# Altium project SmartGarden_A2.PrjPcb
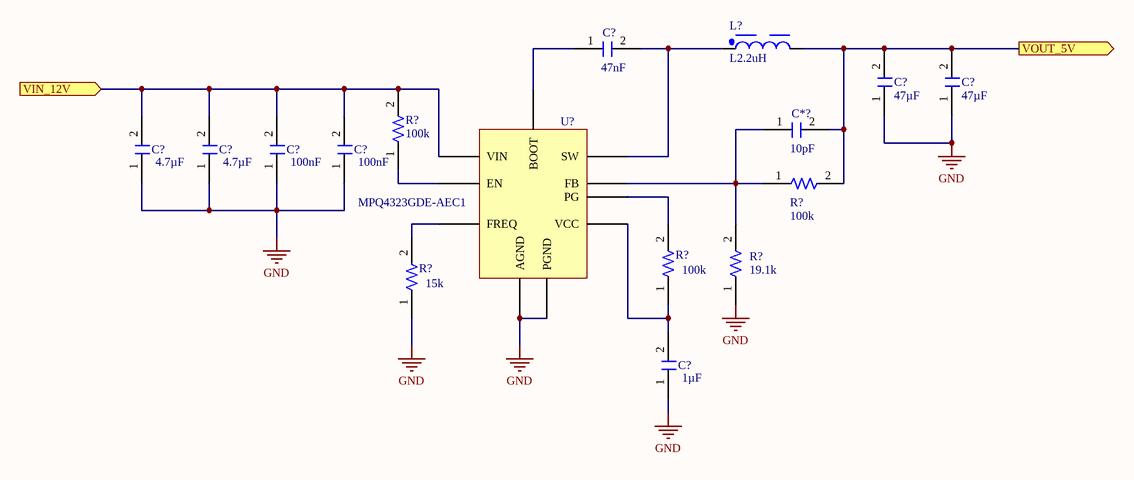
[diagram p0: MPQ4323.SchDoc]
4 sheets, 25 parts. Net scope: hierarchical (ports join the sheet entries above them; power ports are global).
Sheets:
  MPQ4323.SchDoc
  LDO.SchDoc
  MCU.SchDoc
  NTC.SchDoc

## Sheet MPQ4323.SchDoc
size A4; SheetNumber: 6; SheetTotal: 6

### Parts
(Parts that share a designator on the sheet are numbered #1, #2 ... from top to bottom, then left to right.)
C*?  value 10pF  [WCAP-CSGP_0805_L2W1.25H0.6_Reflow]  (hidden comment: C10pF_0805_50V)
C?#1  value 47nF  [WCAP-CSGP_0805_L2W1.25H0.8_Reflow]  (hidden comment: 885012207096)
C?#2  value 47µF  [C1206FNPC-RW]  (hidden comment: C47u-10V-1206FNPC-X5R)
C?#3  value 47µF  [C1206FNPC-RW]  (hidden comment: C47u-10V-1206FNPC-X5R)
C?#4  value 4.7µF  [C0805FNPC-W]  (hidden comment: C4.7u-0805FNPC-X5R)
C?#5  value 4.7µF  [C0805FNPC-W]  (hidden comment: C4.7u-0805FNPC-X5R)
C?#6  value 100nF  [C0805FNPC-R]  (hidden comment: C100n-50V-0805FNPC-X7R)
C?#7  value 100nF  [C0805FNPC-R]  (hidden comment: C100n-50V-0805FNPC-X7R)
C?#8  value 1µF  [C0805FNPC-R]  (hidden comment: C1u-50V-0805FNPC-X7R)
L?  L2.2uH  [WE-PD_7345]
R?#1  value 100k  [RESC2013X70X40NL20T20]  (hidden comment: R100k-0805)
R?#2  value 100k  [RESC2013X70X40NL20T20]  (hidden comment: R100k-0805)
R?#3  value 100k  [RESC2013X70X40NL20T20]  (hidden comment: R100k-0805)
R?#4  value 19.1k  [0805]  (hidden comment: R19.1k_0805)
R?#5  value 15k  [RESC2013X50X30ML20T20]  (hidden comment: R15K-0805)
U?  MPQ4323GDE-AEC1  [MPQ4323]

### Ports
VIN_12V (in, see SG_A2 Architecture[1C]), VOUT_5V (out, see SG_A2 Architecture[1C])

### Nets
GND: C?#2.1 C?#3.1 C?#4.1 C?#5.1 C?#6.1 C?#7.1 C?#8.1 R?#4.1 R?#5.1 U?.4(AGND) U?.5(PGND)
NetC*?_1: C*?.1 R?#2.1 R?#4.2 U?.8(FB)
NetC*?_2: C*?.2 C?#2.2 C?#3.2 L?.2 R?#2.2 ; port VOUT_5V
NetC?#1_1: C?#1.1 U?.10(BOOT)
NetC?#1_2: C?#1.2 L?.1 U?.9(SW)
NetC?#4_2: C?#4.2 C?#5.2 C?#6.2 C?#7.2 R?#1.2 U?.1(VIN) ; port VIN_12V
NetC?#8_2: C?#8.2 R?#3.1 U?.6(VCC)
NetR?#1_1: R?#1.1 U?.2(EN)
NetR?#3_2: R?#3.2 U?.7(PG)
NetR?#5_2: R?#5.2 U?.3(FREQ)

### Library data of the parts
C*? = CMP-001-00012-2: Ceramic Capacitor, Multilayer, Ceramic, 50V, 5% +Tol, 5% -Tol, C0G, 30ppm/Cel TC, 0.00001uF, Surface Mount, 0805. 885012007051; Pins: 2; RoHS Compliant: Yes; Capacitor Type: Ceramic
C?#1 = CMP-001-00011-1: Ceramic Capacitor, Ceramic; RoHS Compliant: Yes; Capacitor Type: Ceramic; Pins: 2
C?#2 C?#3 = CMP-00059-1: Multilayer Ceramic Capacitor, Wcap-Csgp Series, 47 F, 20%, X5r, 10 V, 1206 [3216 Metric]; Manufacturer Part Number 1: 885012108012; Manufacturer 1: Wurth Electronics; Voltage Rating (DC): 10V; .Creator: GP; Packaging: Cut Tape; ComponentLink4Description: Wurth Elektronik; Max Operating Temperature: 85°C; RoHS: Yes; Case Code (Metric): 3216; Length: 0.126inch; Tolerance: 20%; RoHS Compliant: Yes; Source: Passives.SchLib; Min Operating Temperature: -55°C; Stock 1: 2003; Case/Package: 1206; Category: Ceramic Capacitors; ComponentLink3Description: http://www.farnell.com/datasheets/1958457.pdf?src-supplier=Element14; Mount: Surface Mount; Width: 0.063inch; Dielectric: X5R; ComponentLink4URL: https://www.we-online.com/catalog/en/WCAP-CSGP-10VDC?sq=885012108012#885012108012; ComponentLink2URL: https://katalog.we-online.de/pbs/datasheet/885012108012.pdf?src-supplier=Digi-Key; Voltage Rating: 10V; ComponentLink1Description: http://www.farnell.com/datasheets/1958457.pdf?src-supplier=Farnell; Thickness: 0.075inch; REACH SVHC: Unknown; ComponentLink3URL: http://www.farnell.com/datasheets/1958457.pdf?src-supplier=Element14; ComponentLink2Description: https://katalog.we-online.de/pbs/datasheet/885012108012.pdf?src-supplier=Digi-Key; ComponentLink1URL: http://www.farnell.com/datasheets/1958457.pdf?src-supplier=Farnell; Pricing 1: 1=1,26000, 10=1,14000, 100=1,02200, 500=0,90400 (USD); Design Item ID: C47u-10V-1206FNPC-X5R
C?#4 C?#5 = CMP-00047-1: 0805 4.7 uF 10 V ±10% Tolerance X5R Surface Mount Multilayer Ceramic Capacitor; Manufacturer: Murata; Manufacturer Part Number: GRM219R61A475KE34D; Voltage Rating: 10V; .Creator: GP; ComponentLink1URL: https://eu.mouser.com/datasheet/2/396/taiyo_yuden_12132018_mlcc11_hq_e-1510082.pdf; Source: Passives.SchLib; Length: 2mm; ComponentLink5URL: https://datasheet.ciiva.com/16467/product-16467258.pdf?src-supplier=Future+Electronics; RoHS: Yes; Depth: 1.25mm; Pricing 1: 1=0,28000, 10=0,19500, 50=0,13020, 100=0,11070, 500=0,07814, 1000=0,06838 (USD); Width: 0.049inch; ComponentLink7URL: https://datasheet.ciiva.com/29542/product-29542668.pdf?src-supplier=Digi-Key; Category: Capacitor; Voltage: 10V; Thickness: 0.037inch; Max Operating Temperature: 85°C; ComponentLink2Description: Where buy it; Voltage Rating (DC): 10V; Design Item ID: C4.7u-0805FNPC-X5R; Min Operating Temperature: -55°C; Package Quantity: 4000; Stock 1: 626992; ComponentLink4URL: https://datasheet.ciiva.com/5414/product-5414984.pdf?src-supplier=Mouser; ComponentLink4Description: https://datasheet.ciiva.com/5414/product-5414984.pdf?src-supplier=Mouser; ComponentLink7Description: https://datasheet.ciiva.com/29542/product-29542668.pdf?src-supplier=Digi-Key; Lead Free: Lead Free; ComponentLink6URL: https://datasheet.ciiva.com/29542/product-29542667.pdf?src-supplier=Digi-Key; ComponentLink2URL: https://eu.mouser.com/ProductDetail/Taiyo-Yuden/UMK212BJ224KGHT?qs=CNQs48zzdnpf%2FbZJTfp33Q%3D%3D; Construction: Flat; Packaging: Tape and Reel; Tolerance: 10%; Case Code (Metric): 2012; RoHS Compliant: Yes; Mount: Surface Mount; ComponentLink6Description: https://datasheet.ciiva.com/29542/product-29542667.pdf?src-supplier=Digi-Key; ComponentLink3URL: https://datasheet.ciiva.com/169/product-169527.pdf?src-supplier=Digi-Key; Case/Package: 0805; Height: 0.85mm; Termination: SMD/SMT; ComponentLink3Description: https://datasheet.ciiva.com/169/product-169527.pdf?src-supplier=Digi-Key; Series: GRM; ComponentLink1Description: Datasheet; ComponentLink5Description: https://datasheet.ciiva.com/16467/product-16467258.pdf?src-supplier=Future+Electronics; Dielectric: X5R
C?#6 C?#7 = CMP-00063-1: Cap, 0.1ΜF, 50V, 10%, X7R, 0805; Manufacturer 1: Wurth Electronics; Manufacturer Part Number 1: 885012207098; .Creator: DR; Pricing 1: 100=0,10200, 500=0,07100, 2000=0,06100 (GBP); ComponentLink1URL: http://www.farnell.com/datasheets/1958498.pdf?src-supplier=Farnell; Design Item ID: C100n-50V-0805FNPC-X7R; Voltage Rating (DC): 50V; Voltage Rating: 50V; Max Operating Temperature: 125°C; RoHS: Yes; Case Code (Metric): 2012; Mount: Surface Mount; REACH SVHC: Unknown; Stock 1: 8000; Source: Passives.SchLib; Tolerance: 10%; RoHS Compliant: Yes; Dielectric: X7R; ComponentLink2Description: http://www.farnell.com/datasheets/1958498.pdf?src-supplier=Element14; ComponentLink2URL: http://www.farnell.com/datasheets/1958498.pdf?src-supplier=Element14; Min Operating Temperature: -55°C; Width: 0.049inch; Category: Ceramic Capacitors; Thickness: 0.035inch; Length: 0.079inch; ComponentLink3URL: https://katalog.we-online.de/pbs/datasheet/885012207098.pdf?src-supplier=Digi-Key; Case/Package: 0805; ComponentLink3Description: https://katalog.we-online.de/pbs/datasheet/885012207098.pdf?src-supplier=Digi-Key; Packaging: Cut Tape; ComponentLink1Description: http://www.farnell.com/datasheets/1958498.pdf?src-supplier=Farnell; ComponentLink4Description: http://www.farnell.com/datasheets/1958498.pdf?src-supplier=Newark; ComponentLink4URL: http://www.farnell.com/datasheets/1958498.pdf?src-supplier=Newark
C?#8 = CMP-00052-1: Multilayer Ceramic Capacitor, Wcap-Csgp Series, 1 F, 10%, X7R, 50 V, 0805 [2012 Metric] Rohs Compliant: Yes; Manufacturer Part Number 1: 885012207103; Manufacturer 1: Wurth Electronics; Voltage Rating (DC): 50V; .Creator: GP; Max Operating Temperature: 85°C; Case/Package: 0805; ComponentLink1Description: http://www.farnell.com/datasheets/1958501.pdf?src-supplier=Farnell; Design Item ID: C1u-50V-0805FNPC-X7R; ComponentLink1URL: http://www.farnell.com/datasheets/1958501.pdf?src-supplier=Farnell; ComponentLink2Description: http://www.farnell.com/datasheets/1958501.pdf?src-supplier=Element14; ComponentLink3URL: https://katalog.we-online.de/pbs/datasheet/885012107003.pdf?src-supplier=Digi-Key; ComponentLink4Description: http://www.farnell.com/datasheets/1958501.pdf?src-supplier=Newark; Width: 0.049inch; RoHS Compliant: Yes; Case Code (Metric): 2012; Source: Passives.SchLib; Category: Ceramic Capacitors; Tolerance: 10%; Pricing 1: 50=0,27200, 250=0,25300, 500=0,22800, 1250=0,20100, 2500=0,17100 (GBP); RoHS: Yes; Mount: Surface Mount; Min Operating Temperature: -55°C; ComponentLink4URL: http://www.farnell.com/datasheets/1958501.pdf?src-supplier=Newark; Dielectric: X7R; ComponentLink3Description: https://katalog.we-online.de/pbs/datasheet/885012107003.pdf?src-supplier=Digi-Key; ComponentLink2URL: http://www.farnell.com/datasheets/1958501.pdf?src-supplier=Element14; REACH SVHC: Unknown; Length: 0.079inch; Packaging: Cut Tape; Thickness: 0.053inch; Stock 1: 5100; Voltage Rating: 50V
L? = CMP-006-00004-1: General Purpose Inductor, 2.2uH, 20%, 1 Element, Ferrite-Core, SMD. 744777002; Max Current Rating: 6A; Self Resonant Frequency: 60MHz; Pins: 2; RoHS Compliant: Yes; Tolerance: 20%; Min Operating Temperature: -40°C; Max Operating Temperature: 125°C
R?#1-R?#3 = CMP-009-00003-2: Fixed Resistor, Metal Glaze/thick Film, 0.125W, 100000ohm, 150V, 5% +/-Tol, 200ppm/Cel, Surface Mount, 0805; Power: 125mW; Max Operating Temperature: 155°C; Mounting Technology: Surface Mount; RoHS Compliant: Yes; Min Operating Temperature: -55°C; Pins: 2; Case/Package: 0805; Tolerance: 5%
R?#4 = CMP-009-00013-1: Fixed Resistor, Thin Film, 0.125W, 19100ohm, 100V, 0.1% +/-Tol, 15ppm/Cel, Surface Mount, 0805. ERA6APB1912V; Power: 125mW; Tolerance: 0.1%; Min Operating Temperature: -55°C; Mounting Technology: Surface Mount; Case/Package: 0805; Max Operating Temperature: 155°C; Pins: 2; RoHS Compliant: Yes
R?#5 = CMP-009-00005-1: Fixed Resistor, Metal Glaze/thick Film, 0.125W, 15000ohm, 150V, 1% +/-Tol, 100ppm/Cel, Surface Mount, 0805; Power: 125mW; Min Operating Temperature: -55°C; Mounting Technology: Surface Mount; RoHS Compliant: No; Tolerance: 1%; Pins: 2; Max Operating Temperature: 155°C; Case/Package: 0805
U? = CMP-031-00007-1: MPQ4323 – 42V LOAD DUMP, 3A, LOW IQ, SYNC STEP-DOWN CONVERTER, AEC-Q100; pin to pad: 1>2 2>9 3>4 4>6 5>1 6>5 7>8 8>7 9>12 10>3; Min Supply Voltage: 3.3V; Max Supply Voltage: 36V; Max Operating Temperature: 150°C; RoHS Compliant: Yes; Min Operating Temperature: -40°C; Pins: 12; Mounting Technology: SMD; Case/Package: QFN12 (2mmx3mm)

## Sheet LDO.SchDoc
size A4; SheetNumber: 5; SheetTotal: 5

## Sheet MCU.SchDoc
size A4; SheetNumber: 4; SheetTotal: 5
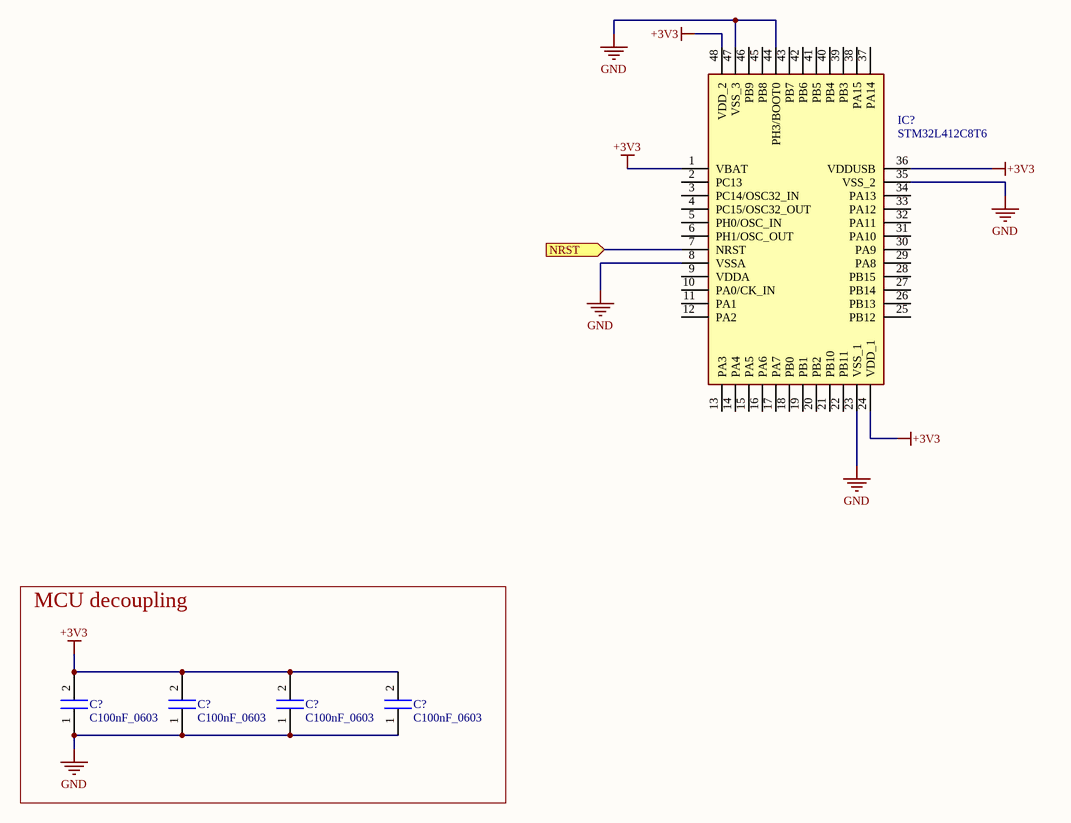
[diagram p1: MCU.SchDoc]

### Parts
(Parts that share a designator on the sheet are numbered #1, #2 ... from top to bottom, then left to right.)
C?#9  C100nF_0603  [Chip2PinSM127P600-8N]
C?#10  C100nF_0603  [Chip2PinSM127P600-8N]
C?#11  C100nF_0603  [Chip2PinSM127P600-8N]
C?#12  C100nF_0603  [Chip2PinSM127P600-8N]
IC?  STM32L412C8T6  [QFP50P900X900X160-48N]

### Blocks framed on the sheet
MCU decoupling: C?#9-C?#12

### Ports
NRST (in)

### Nets
+3V3: C?#9.2 C?#10.2 C?#11.2 C?#12.2 IC?.1(VBAT) IC?.24(VDD_1) IC?.36(VDDUSB) IC?.48(VDD_2)
GND: C?#9.1 C?#10.1 C?#11.1 C?#12.1 IC?.8(VSSA) IC?.23(VSS_1) IC?.35(VSS_2) IC?.44(PH3/BOOT0) IC?.47(VSS_3)
NetIC?_7: IC?.7(NRST) ; port NRST

Not connected (* = marked no-connect by the designer): IC? 2(PC13) 3(PC14/OSC32_IN) 4(PC15/OSC32_OUT) 5(PH0/OSC_IN) 6(PH1/OSC_OUT) 9(VDDA) 10(PA0/CK_IN) 11(PA1) 12(PA2) 13(PA3) 14(PA4) 15(PA5) 16(PA6) 17(PA7) 18(PB0) 19(PB1) 20(PB2) 21(PB10) 22(PB11) 25(PB12) 26(PB13) 27(PB14) 28(PB15) 29(PA8) 30(PA9) 31(PA10) 32(PA11) 33(PA12) 34(PA13) 37(PA14) 38(PA15) 39(PB3) 40(PB4) 41(PB5) 42(PB6) 43(PB7) 45(PB8) 46(PB9)

### Library data of the parts
IC? = STM32L412C8T6: STMICROELECTRONICS - STM32L412C8T6 - MCU, 32BIT, 80MHZ; Geometry.Height: 1.6mm; Mouser Part Number: 511-STM32L412C8T6; Mouser Price/Stock: https://www.mouser.co.uk/ProductDetail/STMicroelectronics/STM32L412C8T6?qs=l7cgNqFNU1hAS2azFRLB0A%3D%3D; Manufacturer_Name: STMicroelectronics; Manufacturer_Part_Number: STM32L412C8T6; Datasheet Link: https://www.st.com/resource/en/datasheet/stm32l412c8.pdf

## Sheet NTC.SchDoc
size A4; SheetNumber: 3; SheetTotal: 4
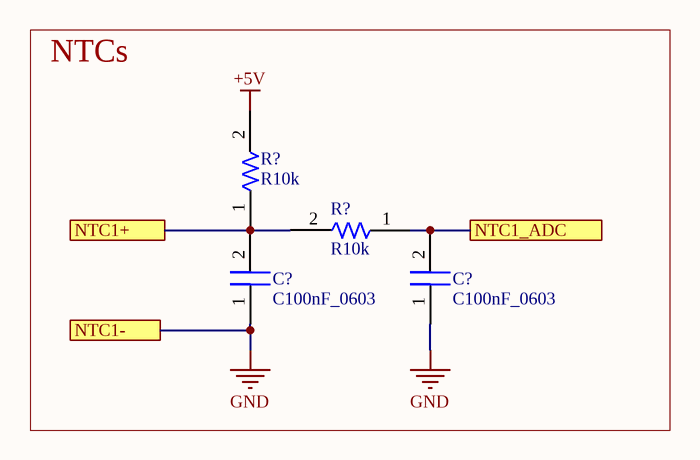
[diagram p2: NTC.SchDoc]

### Parts
(Parts that share a designator on the sheet are numbered #1, #2 ... from top to bottom, then left to right.)
C?#13  C100nF_0603  [Chip2PinSM127P600-8N]
C?#14  C100nF_0603  [Chip2PinSM127P600-8N]
R?#6  R10k  [R0603]
R?#7  R10k  [R0603]

### Blocks framed on the sheet
NTCs: C?#13 C?#14 R?#6 R?#7

### Ports
NTC1+, NTC1-, NTC1_ADC

### Nets
+5V: R?#6.2
GND: C?#13.1 C?#14.1 ; port NTC1-
NetC?#13_2: C?#13.2 R?#6.1 R?#7.2 ; port NTC1+
NetC?#14_2: C?#14.2 R?#7.1 ; port NTC1_ADC

### Library data of the parts
R?#6 R?#7 = R10k_0603

## Nets that join several sheets
GND: MPQ4323 (11 pins), MCU (9 pins), NTC (C?#13.1 C?#14.1)